# EAGLE schematic emonDCduo-ESP v2.3_consistency_error (EAGLE 9.2.1)
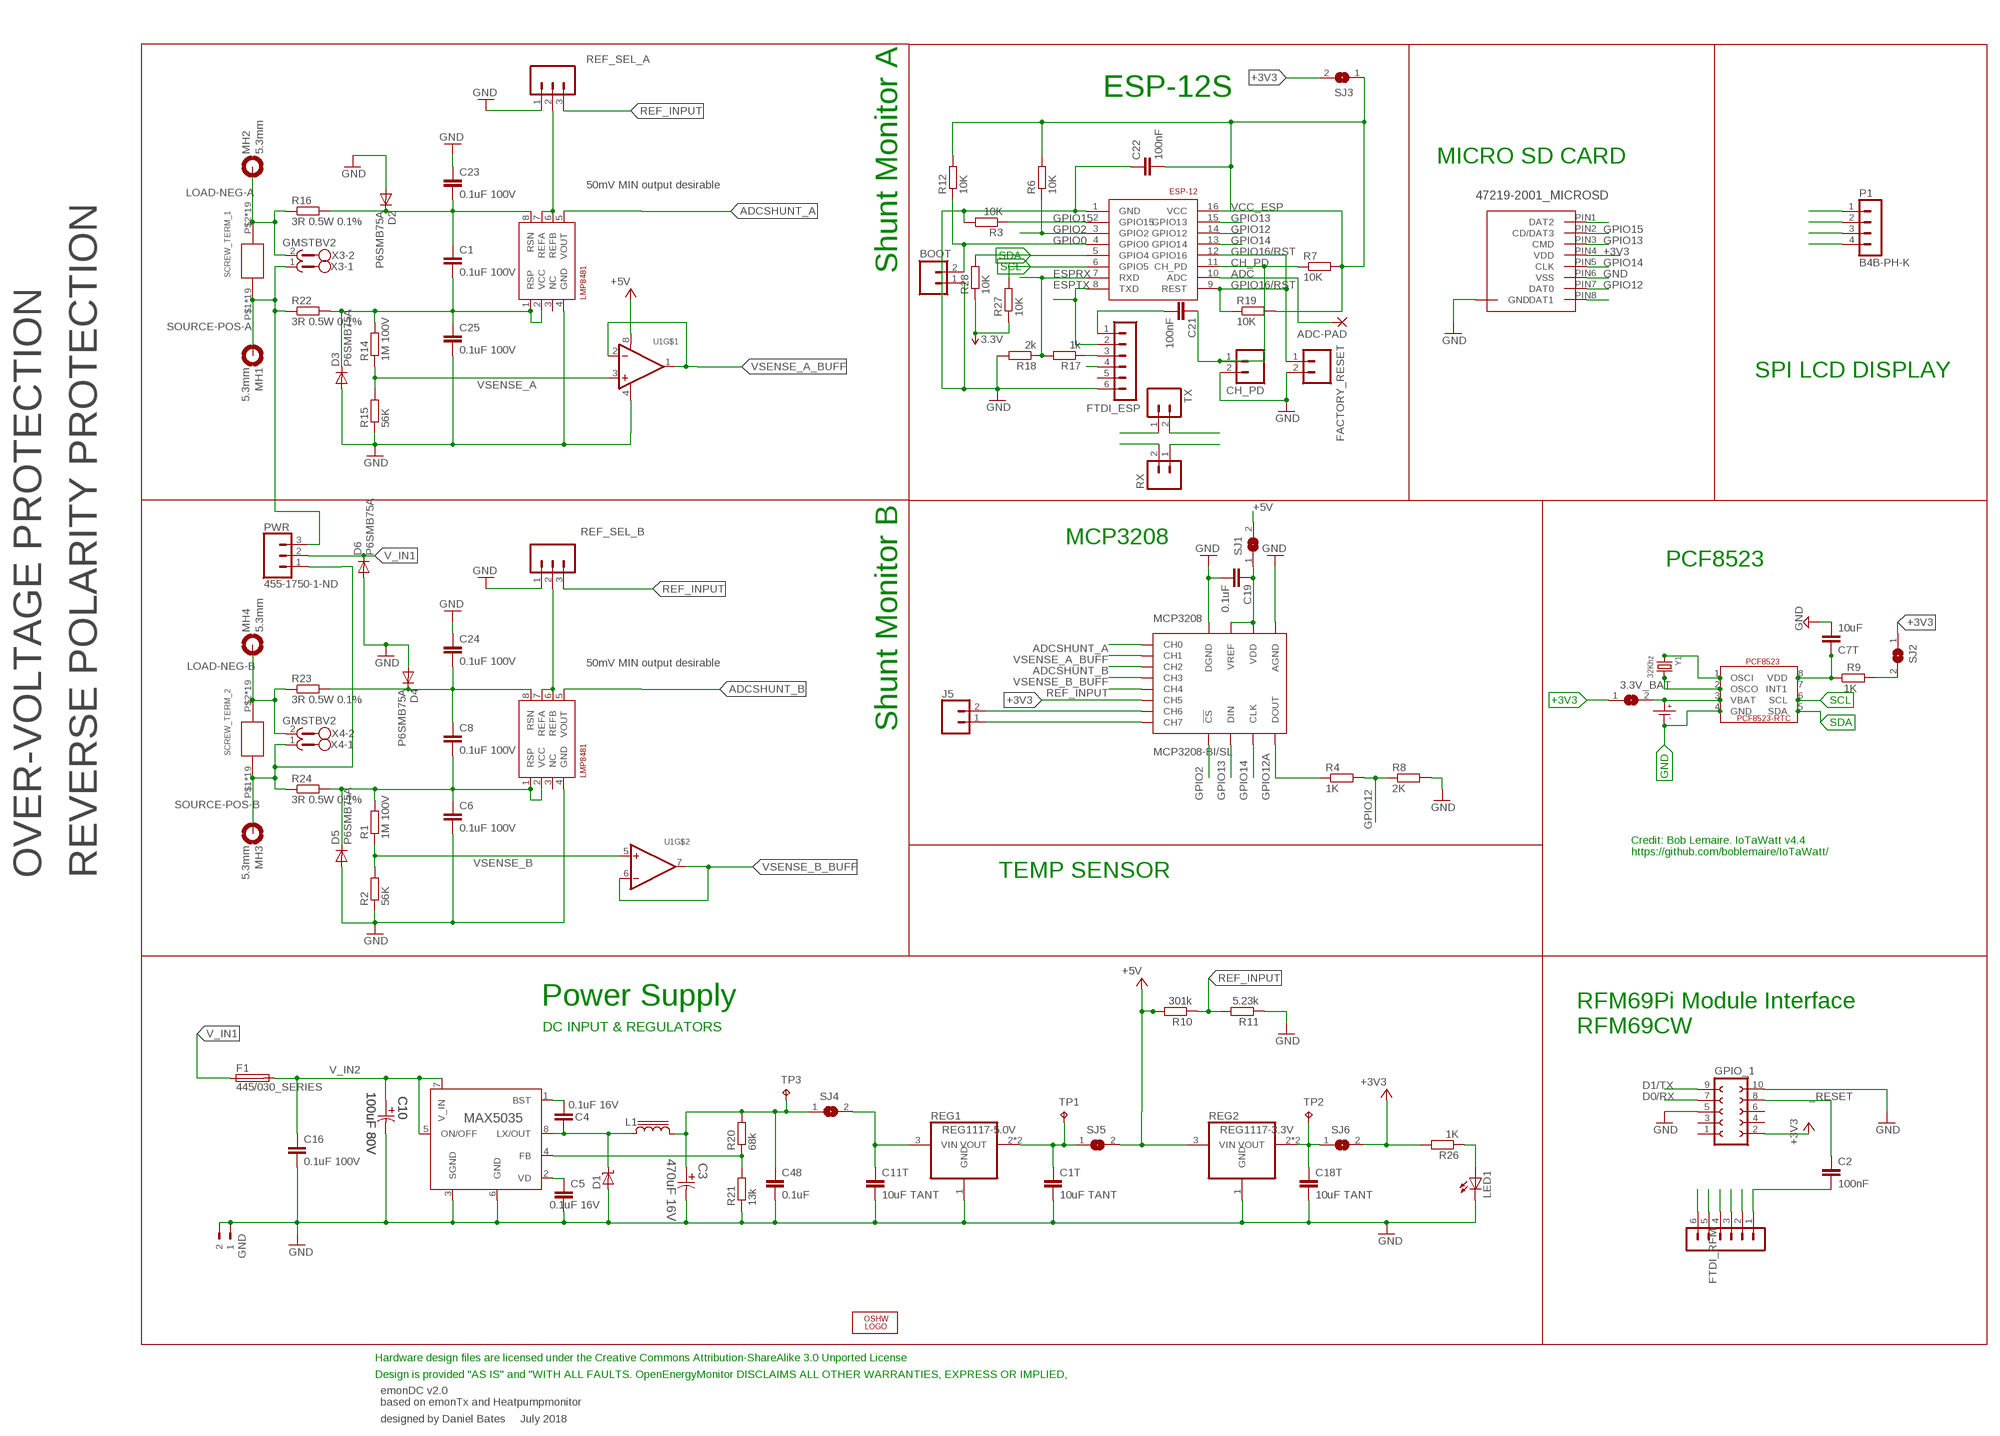
[diagram p0: schematic, sheet 1]

## Parts
3.3V_BAT  SJ-CONCON  [SJ-CON]
ADC-PAD  2,15/1,0  [2,15/1,0]
BOOT  M02PTH  [1X02]
C1  0.1uF 100V  C-EUC0603  [C0603]
C1T  10uF TANT  C-EUC0603  [C0603]
C2  100nF  C-EUC0603  [C0603]
C3  470uF 16V  EEE-FK1C471P-CASE-F  [CAPAE830X1050N]
C4  0.1uF 16V  C-EUC0603  [C0603]
C5  0.1uF 16V  C-EUC0603  [C0603]
C6  0.1uF 100V  C-EUC0603  [C0603]
C7T  10uF  C-EUC0603  [C0603]
C8  0.1uF 100V  C-EUC0603  [C0603]
C10  100uF 80V  EEV-FK1K101Q-CASE-H13  [CAPAE1350X1400N]
C11T  10uF TANT  C-EUC0603  [C0603]
C16  0.1uF 100V  C-EUC0603  [C0603]
C18T  10uF TANT  C-EUC0603  [C0603]
C19  0.1uF  C-EUC0603  [C0603]
C21  100nF  C-EUC0603  [C0603]
C22  100nF  C-EUC0603  [C0603]
C23  0.1uF 100V  C-EUC0603  [C0603]
C24  0.1uF 100V  C-EUC0603  [C0603]
C25  0.1uF 100V  C-EUC0603  [C0603]
C48  0.1uF  C-EUC0603  [C0603]
CH_PD  M02PTH  [1X02]
CR1220  CR1220SMD  [CR1220SMD]
D1  MBRS1100T3G  [SMB_1]
D2  P6SMB75A  DIODE-DO214AA  [DO214AA]
D3  P6SMB75A  DIODE-DO214AA  [DO214AA]
D4  P6SMB75A  DIODE-DO214AA  [DO214AA]
D5  P6SMB75A  DIODE-DO214AA  [DO214AA]
D6  P6SMB75A  DIODE-DO214AA  [DO214AA]
ESP-12  ESP8266_ESP-12  [ESP8266-ESP12]
F1  445/030_SERIES  [445/030_SERIES_LITTELFUSE]
FTDI_ESP  FTDI_ESP  MA06-1  [MA06-1]
FTDI_RFM  FTDI_RFM  MA06-1  [MA06-1]
GND  180-2  [180-2]
GPIO_1  FE05-2_RFM69PI_OUTLINERFM69PI  [FE05-2_RFM69PI_OULTINE]
IO16  FACTORY_RESET  M02PTH  [1X02]
J5  CONN_02  [1X02]
L1  SRR1208  [SSR1208]
LED1  LEDCHIP-LED0805  [CHIP-LED0805]
LOGO1  OSHW_LOGO_6MILX0200-NT  [OSHW_6X200_NOTEXT]
MCP3208  MCP3208-BI/SL  [SOIC16]
MH1  5.3mm  MOUNT-PAD-ROUND5.3  [5,3//11-PAD]
MH2  5.3mm  MOUNT-PAD-ROUND5.3  [5,3//11-PAD]
MH3  5.3mm  MOUNT-PAD-ROUND5.3  [5,3//11-PAD]
MH4  5.3mm  MOUNT-PAD-ROUND5.3  [5,3//11-PAD]
MICRO_SD  47219-2001_MICROSD  [47219-2001_MICROSD]
P1  B4B-PH-K  [B4B-PH-K]
PCF8523  PCF8523_RTC  [SOIC_8]
PWR  455-1750-1-ND  CONN_03  [1X03]
R1  1M 100V  R-EU_R0603  [R0603]
R2  56K  R-EU_R0603  [R0603]
R3  10K  R-EU_R0603  [R0603]
R4  1K  R-EU_R0603  [R0603]
R6  10K  R-EU_R0603  [R0603]
R7  10K  R-EU_R0603  [R0603]
R8  2K  R-EU_R0603  [R0603]
R9  1K  R-EU_R0603  [R0603]
R10  301k  R-EU_0204/7  [0204/7]
R11  5.23k  R-EU_0204/7  [0204/7]
R12  10K  R-EU_R0603  [R0603]
R14  1M 100V  R-EU_R0603  [R0603]
R15  56K  R-EU_R0603  [R0603]
R16  3R 0.5W 0.1%  R-EU_R0805  [R0805]
R17  1k  R-EU_R0603  [R0603]
R18  2k  R-EU_R0603  [R0603]
R19  10K  R-EU_R0603  [R0603]
R20  68k  R-EU_R0603  [R0603]
R21  13k  R-EU_R0603  [R0603]
R22  3R 0.5W 0.1%  R-EU_R0805  [R0805]
R23  3R 0.5W 0.1%  R-EU_R0805  [R0805]
R24  3R 0.5W 0.1%  R-EU_R0805  [R0805]
R26  1K  R-EU_R0603  [R0603]
R27  10K  R-EU_R0603  [R0603]
R28  10K  R-EU_R0603  [R0603]
REF_SEL_A  455-1750-1-ND  CONN_03  [1X03]
REF_SEL_B  455-1750-1-ND  CONN_03  [1X03]
REG0  MAX5035  [21-0111D_SBE-14]
REG1  REG1117-5.0V  REG1117  [SOT223]
REG2  REG1117-3.3V  REG1117  [SOT223]
RX  M02PTH  [1X02]
SCREW_TERM_1  EBW_SERIES_15.2MM  [EBW_SERIES_15.2MM]
SCREW_TERM_2  EBW_SERIES_15.2MM  [EBW_SERIES_15.2MM]
SHUNTMON-A  LMP8481  LMP8481-H  [S-PDSO-G08]
SHUNTMON-B  LMP8481  LMP8481-H  [S-PDSO-G08]
SJ1  SJ-CONCON  [SJ-CON]
SJ2  SJ-CONCON  [SJ-CON]
SJ3  SJ-CONCON  [SJ-CON]
SJ4  SJ-CONCON  [SJ-CON]
SJ5  SJ-CONCON  [SJ-CON]
SJ6  SJ-CONCON  [SJ-CON]
TP1  TPPAD1-13  [P1-13]
TP2  TPPAD1-13  [P1-13]
TP3  TPPAD1-13  [P1-13]
TX  M02PTH  [1X02]
U1  LM358  [SOIC8_150MIL]
X3  GMSTBV2  [GMSTBV2]
X4  GMSTBV2  [GMSTBV2]
Y1  32Khz  CRYSTAL8X3.8SMT  [CRYSTAL_8X3.8]

## Nets
3.3V_PRE: C18T.1 REG2.2(VOUT) REG2.4(VOUT) SJ6.1 TP2.TP
5V_PRE [power]: C1T.1 REG1.2(VOUT) REG1.4(VOUT) SJ5.1 TP1.TP
6.5V: C11T.1 REG1.3(VIN) SJ4.2
+3V3: 3.3V_BAT.1 GPIO_1.2 MCP3208.6(CH5) MICRO_SD.PIN4(VDD) P1.3 R26.2 R27.1 R28.1 SJ2.1 SJ3.2 SJ6.2 ; supply symbol labelled 3.3V
+5V: FTDI_ESP.4 FTDI_RFM.4 R10.2 REG2.3(VIN) SJ1.2 SJ5.2 U1.8(V+)
_RESET: C2.1 GPIO_1.8
ADC: ADC-PAD.1(P) ESP-12.10(ADC)
ADCSHUNT_A: MCP3208.1(CH0) SHUNTMON-A.5(VOUT)
ADCSHUNT_B: MCP3208.3(CH2) SHUNTMON-B.5(VOUT)
BST: C4.1 REG0.1(BST)
CH6: J5.2 MCP3208.7(CH6)
CH7: J5.1 MCP3208.8(CH7)
CH_PD: C21.1 CH_PD.1 ESP-12.11(CH_PD) R7.1
D0/RX: FTDI_RFM.2 GPIO_1.7 TX.2
D1/TX: FTDI_RFM.3 GPIO_1.9 RX.1
ESPRX: ESP-12.7(RXD) R17.2 R18.1 RX.2
ESPTX: ESP-12.8(TXD) FTDI_ESP.2 TX.1
GND [thin_power]: BOOT.1 C1T.2 C3.2 C5.2 C6.2 C7T.2 C10.2 C11T.2 C16.2 C18T.2 C19.2 C22.1 C23.1 C24.1 C25.2 C48.2 CH_PD.2 CR1220.P-(P$-) D1.A D2.A D3.A D4.A D5.A D6.A ESP-12.1(GND) FTDI_ESP.6 FTDI_RFM.6 GND.1 GND.2 GPIO_1.5 GPIO_1.10 IO16.2 LED1.C MCP3208.9(DGND) MCP3208.14(AGND) MICRO_SD.P$1(GND) MICRO_SD.P$2(GND) MICRO_SD.P$3(GND) MICRO_SD.P$4(GND) MICRO_SD.PIN6(VSS) P1.4 PCF8523.4(GND) R2.1 R3.2 R8.2 R11.1 R15.1 R18.2 R21.1 REF_SEL_A.1 REF_SEL_B.1 REG0.3(SGND) REG0.6(GND) REG1.1(GND) REG2.1(GND) SHUNTMON-A.4(GND) SHUNTMON-B.4(GND) U1.4(V-)
GPIO0: BOOT.2 ESP-12.4(GPIO0) R12.1
GPIO2: ESP-12.3(GPIO2) MCP3208.10(!CS) R6.1
GPIO12: ESP-12.14(GPIO12) MICRO_SD.PIN7(DAT0) R4.2 R8.1
GPIO12A: MCP3208.12(DOUT) R4.1
GPIO13: ESP-12.15(GPIO13) MCP3208.11(DIN) MICRO_SD.PIN3(CMD)
GPIO14: ESP-12.13(GPIO14) MCP3208.13(CLK) MICRO_SD.PIN5(CLK)
GPIO15 [thin_power]: ESP-12.2(GPIO15) MICRO_SD.PIN2(CD/DAT3) R3.1
GPIO16/RST: ESP-12.9(REST) ESP-12.12(GPIO16) IO16.1 R19.1
LOAD-NEG-A: MH2.B5,5(MOUNT) R16.1 SCREW_TERM_1.P$2 SCREW_TERM_1.P$18 SCREW_TERM_1.P$19 SCREW_TERM_1.P$20 SCREW_TERM_1.P$21 SCREW_TERM_1.P$22 SCREW_TERM_1.P$23 SCREW_TERM_1.P$24 SCREW_TERM_1.P$25 SCREW_TERM_1.P$26 SCREW_TERM_1.P$27 SCREW_TERM_1.P$28 SCREW_TERM_1.P$29 SCREW_TERM_1.P$30 SCREW_TERM_1.P$31 SCREW_TERM_1.P$32 SCREW_TERM_1.P$36 SCREW_TERM_1.P$37 SCREW_TERM_1.P$38 X3.2
LOAD-NEG-B: MH4.B5,5(MOUNT) R23.1 SCREW_TERM_2.P$2 SCREW_TERM_2.P$18 SCREW_TERM_2.P$19 SCREW_TERM_2.P$20 SCREW_TERM_2.P$21 SCREW_TERM_2.P$22 SCREW_TERM_2.P$23 SCREW_TERM_2.P$24 SCREW_TERM_2.P$25 SCREW_TERM_2.P$26 SCREW_TERM_2.P$27 SCREW_TERM_2.P$28 SCREW_TERM_2.P$29 SCREW_TERM_2.P$30 SCREW_TERM_2.P$31 SCREW_TERM_2.P$32 SCREW_TERM_2.P$36 SCREW_TERM_2.P$37 SCREW_TERM_2.P$38 X4.2
LX: C4.2 D1.C L1.1 REG0.8(LX/OUT)
MCP_VCC [power]: C19.1 MCP3208.15(VREF) MCP3208.16(VDD) SJ1.1
N$1: R20.1 R21.2 REG0.4(FB)
N$5: LED1.A R26.1
N$7: MICRO_SD.PIN1(DAT2)
N$10: C7T.1 PCF8523.8(VDD) R9.1
N$17: C1.1 C23.2 D2.C R16.2 SHUNTMON-A.8(RSN)
N$20: FTDI_RFM.5
N$22: C8.1 C24.2 D4.C R23.2 SHUNTMON-B.8(RSN)
N$23: C1.2 C25.1 D3.C R14.2 R22.2 SHUNTMON-A.1(RSP) SHUNTMON-A.2(VCC)
N$24: R9.2 SJ2.2
N$30: C21.2 FTDI_ESP.1
N$32: MICRO_SD.PIN8(DAT1)
N$36: FTDI_ESP.3 R17.1
N$44: PCF8523.2(OSCO) Y1.P$4
N$45: PCF8523.1(OSCI) Y1.P$1
N$301: C2.2 FTDI_RFM.1
PRE_6.5V: C3.1 C48.1 L1.2 R20.2 SJ4.1 TP3.TP
REF_A_INPUT: REF_SEL_A.2 SHUNTMON-A.6(REFB) SHUNTMON-A.7(REFA)
REF_B_INPUT [thin_power]: REF_SEL_B.2 SHUNTMON-B.6(REFB) SHUNTMON-B.7(REFA)
REF_INPUT: MCP3208.5(CH4) R10.1 R11.2 REF_SEL_A.3 REF_SEL_B.3
SCL: ESP-12.6(GPIO5) P1.2 PCF8523.6(SCL) R27.2
SDA: ESP-12.5(GPIO4) P1.1 PCF8523.5(SDA) R28.2
SOURCE-POS-A: MH1.B5,5(MOUNT) PWR.3 R22.1 SCREW_TERM_1.P$1 SCREW_TERM_1.P$3 SCREW_TERM_1.P$4 SCREW_TERM_1.P$5 SCREW_TERM_1.P$6 SCREW_TERM_1.P$7 SCREW_TERM_1.P$8 SCREW_TERM_1.P$9 SCREW_TERM_1.P$10 SCREW_TERM_1.P$11 SCREW_TERM_1.P$12 SCREW_TERM_1.P$13 SCREW_TERM_1.P$14 SCREW_TERM_1.P$15 SCREW_TERM_1.P$16 SCREW_TERM_1.P$17 SCREW_TERM_1.P$33 SCREW_TERM_1.P$34 SCREW_TERM_1.P$35 X3.1
SOURCE-POS-B [power]: MH3.B5,5(MOUNT) PWR.1 R24.1 SCREW_TERM_2.P$1 SCREW_TERM_2.P$3 SCREW_TERM_2.P$4 SCREW_TERM_2.P$5 SCREW_TERM_2.P$6 SCREW_TERM_2.P$7 SCREW_TERM_2.P$8 SCREW_TERM_2.P$9 SCREW_TERM_2.P$10 SCREW_TERM_2.P$11 SCREW_TERM_2.P$12 SCREW_TERM_2.P$13 SCREW_TERM_2.P$14 SCREW_TERM_2.P$15 SCREW_TERM_2.P$16 SCREW_TERM_2.P$17 SCREW_TERM_2.P$33 SCREW_TERM_2.P$34 SCREW_TERM_2.P$35 X4.1
SOURCE-POS-B_T: C6.1 C8.2 D5.C R1.2 R24.2 SHUNTMON-B.1(RSP) SHUNTMON-B.2(VCC)
V_IN1: D6.C F1.P$1 F1.P$2 PWR.2
V_IN2: C10.1 C16.1 F1.P$3 F1.P$4 REG0.5(ON/OFF) REG0.7(V_IN)
VBAT: 3.3V_BAT.2 CR1220.P+(P$+) PCF8523.3(VBAT)
VCC_ESP: C22.2 ESP-12.16(VCC) R6.2 R7.2 R12.2 R19.2 SJ3.1
VD: C5.1 REG0.2(VD)
VSENSE_A: R14.1 R15.2 U1.3(+IN)
VSENSE_A_BUFF: MCP3208.2(CH1) U1.1(OUT) U1.2(-IN)
VSENSE_B: R1.1 R2.2 U1.5(+IN)
VSENSE_B_BUFF: MCP3208.4(CH3) U1.6(-IN) U1.7(OUT)
Unconnected: FTDI_ESP.5 GPIO_1.1 GPIO_1.3 GPIO_1.4 GPIO_1.6 PCF8523.7(INT1) SHUNTMON-A.3(NC) SHUNTMON-B.3(NC)

## Notes on the sheet
- ESP-12S
- MICRO SD CARD
- 50mV MIN output desirable
- Shunt Monitor A
- SPI LCD DISPLAY
- MCP3208
- PCF8523
- 50mV MIN output desirable
- Shunt Monitor B
- Credit: Bob Lemaire. IoTaWatt v4.4
  https://github.com/boblemaire/IoTaWatt/
- OVER-VOLTAGE PROTECTION | REVERSE POLARITY PROTECTION | TEMP SENSOR
- Power Supply
- DC INPUT & REGULATORS
- RFM69Pi Module Interface
  RFM69CW
- Hardware design files are licensed under the Creative Commons Attribution-ShareAlike 3.0 Unported License
- Design is provided "AS IS" and "WITH ALL FAULTS. OpenEnergyMonitor DISCLAIMS ALL OTHER WARRANTIES, EXPRESS OR IMPLIED,
- emonDC v2.0
  based on emonTx and Heatpumpmonitor
- designed by Daniel Bates     July 2018

## Library data of the parts
3.3V_BAT SJ4 = jumper-con:SJ-CON: SMD solder JUMPER
ADC-PAD = wirepad:2,15/1,0: THROUGH-HOLE PAD
BOOT CH_PD IO16 RX TX = SparkFun:M02: Header 2 Standard 2-pin 0.1" header. Use with straight break away headers (SKU : PRT-00116), right angle break away headers (PRT-00553), swiss pins (PRT-00743), machine pins (PRT-00117), and female headers (PRT-00115). Molex polarized connector foot print use with SKU : PRT-08233 with associated crimp pins and housings.
C1 C6 C8 C23-C25 = rcl:C-EU: CAPACITOR, European symbol; MPN: C1608X7S2A104K080AB
C1T C2 C4 C5 C11T C16 C18T C19 C21 C22 C48 = rcl:C-EU: CAPACITOR, European symbol
C3 = Panasonic-EEEFK_EEEFP:EEE-: Aluminum Electrolytic Capacitors,Surface Mount Type; MPN: EEE-FK1C471P; OC_FARNELL: 9695710; OC_NEWARK: 96K9385; PACKAGE: CASE-F; SUPPLIER: PANASONIC; TOLERANCE: ±20 %; VALUE: 470UF; VOLTAGERATING: 16V
C7T = rcl@1:C-EU: CAPACITOR, European symbol
C10 = Panasonic-EEE-EEV-EEF-ECQ:EEV-: Aluminum Electrolytic Capacitors,Surface Mount Type; MPN: EEVFK1K101Q; OC_FARNELL: 9696113; OC_NEWARK: 96K9484; SUPPLIER: PANASONIC; TOLERANCE: ±20 %; VALUE: 100UF; VOLTAGERATING: 80V
CR1220 = IotaWatt_parts:CR1220SMD: CR1220 Battery SMD; MPN: Harwin S8411-45R
D1 = diodes:MBRS1100T3G: MBRS1100T3G 100V 1A Freewheeling Diode; MPN: MBRS1100T3G
D2-D6 = diode:DIODE-: DIODE
ESP-12 = ESP8266-ESP12:ESP8266_ESP-12
F1 = LITTELFUSE 455:030 SERIES:445/030_SERIES: MPN 04450001N
FTDI_ESP FTDI_RFM = JeeLabs:MA06-1: PIN HEADER
GND = con-weidmueller-sl35_db:180-2: WEIDMUELLER CLAMP CONNECTOR; OC_FARNELL: unknown; OC_NEWARK: unknown
GPIO_1 = con-lsta-RFM69Pi:FE05-2_RFM69PI_OUTLINE: FEMALE HEADER
J5 = SparkFun-Connectors:CONN_02: Multi connection point. Often used as Generic Header-pin footprint for 0.1 inch spaced/style header connections On any of the 0.1 inch spaced packages, you can populate with these: Break Away Headers - Straight <https://www.sparkfun.com/products/116> (PRT-00116) Break Away Male Headers - Right Angle <https://www.sparkfun.com/products/553> (PRT-00553) Female Headers <https://www.sparkfun.com/products/115> (PRT-00115) Break Away Headers - Machine Pin <https://www.sparkfun.com/products/117> (PRT-00117) Break Away Female Headers - Swiss Machine Pin <https://www.sparkfun.com/products/743> (PRT-00743) For SCREWTERMINALS and SPRING TERMINALS visit here: Screw Terimnals on SparkFun.com <https://www.sparkfun.com/search/results?term=Screw+Terminals> (5mm/3.5mm/2.54mm spacing) This device is also useful as a general connection point to wire up your design to another part of your project. Our various solder wires solder well into these plated through hole pads. Hook-Up Wire - Assortment (Stranded, 22 AWG) <https://www.sparkfun.com/products/11375> (PRT-11375) Hook-Up Wire - Assortment (Solid Core, 22 AWG) <https://www.sparkfun.com/products/11367> (PRT-11367) View the entire wire category on our website here <https://www.sparkfun.com/categories/141> Special notes: Molex polarized connector foot print use with: PRT-08233 with associated crimp pins and housings. 2.54_SCREWTERM for use with PRT-10571. 3.5mm Screw Terminal footprints for PRT-08084 5mm Screw Terminal footprints for use with PRT-08432
L1 = inductor-bourns:SRR1208: POWER INDUCTOR; MPN: SRR1208-151YL
LED1 = led:LED: LED OSRAM: - CHIPLED LG R971, LG N971, LY N971, LG Q971, LY Q971, LO R971, LY R971 LH N974, LH R974 LS Q976, LO Q976, LY Q976 LO Q996 - Hyper CHIPLED LW Q18S LB Q993, LB Q99A, LB R99A - SideLED LS A670, LO A670, LY A670, LG A670, LP A670 LB A673, LV A673, LT A673, LW A673 LH A674 LY A675 LS A676, LA A676, LO A676, LY A676, LW A676 LS A679, LY A679, LG A679 - Hyper Micro SIDELED® LS Y876, LA Y876, LO Y876, LY Y876 LT Y87S - SmartLED LW L88C, LW L88S LB L89C, LB L89S, LG L890 LS L89K, LO L89K, LY L89K LS L896, LA L896, LO L896, LY L896 - TOPLED LS T670, LO T670, LY T670, LG T670, LP T670 LSG T670, LSP T670, LSY T670, LOP T670, LYG T670 LG T671, LOG T671, LSG T671 LB T673, LV T673, LT T673, LW T673 LH T674 LS T676, LA T676, LO T676, LY T676, LB T676, LH T676, LSB T676, LW T676 LB T67C, LV T67C, LT T67C, LS T67K, LO T67K, LY T67K, LW E67C LS E67B, LA E67B, LO E67B, LY E67B, LB E67C, LV E67C, LT E67C LW T67C LS T679, LY T679, LG T679 LS T770, LO T770, LY T770, LG T770, LP T770 LB T773, LV T773, LT T773, LW T773 LH T774 LS E675, LA E675, LY E675, LS T675 LS T776, LA T776, LO T776, LY T776, LB T776 LHGB T686 LT T68C, LB T68C - Hyper Mini TOPLED® LB M676 - Mini TOPLED Santana® LG M470 LS M47K, LO M47K, LY M47K Source: http://www.osram.convergy.de LUXEON: - LUMILED® LXK2-PW12-R00, LXK2-PW12-S00, LXK2-PW14-U00, LXK2-PW14-V00 LXK2-PM12-R00, LXK2-PM12-S00, LXK2-PM14-U00 LXK2-PE12-Q00, LXK2-PE12-R00, LXK2-PE12-S00, LXK2-PE14-T00, LXK2-PE14-U00 LXK2-PB12-K00, LXK2-PB12-L00, LXK2-PB12-M00, LXK2-PB14-N00, LXK2-PB14-P00, LXK2-PB14-Q00 LXK2-PR12-L00, LXK2-PR12-M00, LXK2-PR14-Q00, LXK2-PR14-R00 LXK2-PD12-Q00, LXK2-PD12-R00, LXK2-PD12-S00 LXK2-PH12-R00, LXK2-PH12-S00 LXK2-PL12-P00, LXK2-PL12-Q00, LXK2-PL12-R00 Source: www.luxeon.com KINGBRIGHT: KA-3528ASYC Source: www.kingbright.com
LOGO1 = ohw-logo:OSHW_LOGO_6MIL; OC_FARNELL: unknown
MCP3208 = MCP3208:MCP3208
MH1-MH4 = holes-db:MOUNT-PAD-ROUND: MOUNTING PAD, round
MICRO_SD = MOLEX 47219-2001:47219-2001_MICROSD
P1 = JST-PH:B4B-PH-K: HEADER
PCF8523 = emonDC parts:PCF8523_RTC: PCF8523-RTC SOIC-8
PWR = SparkFun-Connectors:CONN_03: Multi connection point. Often used as Generic Header-pin footprint for 0.1 inch spaced/style header connections On any of the 0.1 inch spaced packages, you can populate with these: Break Away Headers - Straight <https://www.sparkfun.com/products/116> (PRT-00116) Break Away Male Headers - Right Angle <https://www.sparkfun.com/products/553> (PRT-00553) Female Headers <https://www.sparkfun.com/products/115> (PRT-00115) Break Away Headers - Machine Pin <https://www.sparkfun.com/products/117> (PRT-00117) Break Away Female Headers - Swiss Machine Pin <https://www.sparkfun.com/products/743> (PRT-00743) Stackable Header - 3 Pin (Female, 0.1") <https://www.sparkfun.com/products/13875> (PRT-13875) For SCREWTERMINALS and SPRING TERMINALS visit here: Screw Terimnals on SparkFun.com <https://www.sparkfun.com/search/results?term=Screw+Terminals> (5mm/3.5mm/2.54mm spacing) This device is also useful as a general connection point to wire up your design to another part of your project. Our various solder wires solder well into these plated through hole pads. Hook-Up Wire - Assortment (Stranded, 22 AWG) <https://www.sparkfun.com/products/11375> (PRT-11375) Hook-Up Wire - Assortment (Solid Core, 22 AWG) <https://www.sparkfun.com/products/11367> (PRT-11367) View the entire wire category on our website here <https://www.sparkfun.com/categories/141> Special notes: Molex polarized connector foot print use with SKU : PRT-08232 with associated crimp pins and housings.; PROD_ID: XXX-00000
R1 R14 = rcl:R-EU_: RESISTOR, European symbol; MPN: MCWR06X1003FTL
R2 R4 R8 R15 = rcl:R-EU_: RESISTOR, European symbol; MPN: MCWR06X5901FTL
R3 R6 R7 R12 R17-R19 R27 R28 = rcl:R-EU_: RESISTOR, European symbol
R9 R20 R21 = rcl@1:R-EU_: RESISTOR, European symbol
R10 R11 R16 R22-R24 R26 = rcl:R-EU_: RESISTOR, European symbol; SPICEPREFIX: R
REF_SEL_A REF_SEL_B = SparkFun-Connectors:CONN_03: Multi connection point. Often used as Generic Header-pin footprint for 0.1 inch spaced/style header connections On any of the 0.1 inch spaced packages, you can populate with these: Break Away Headers - Straight <https://www.sparkfun.com/products/116> (PRT-00116) Break Away Male Headers - Right Angle <https://www.sparkfun.com/products/553> (PRT-00553) Female Headers <https://www.sparkfun.com/products/115> (PRT-00115) Break Away Headers - Machine Pin <https://www.sparkfun.com/products/117> (PRT-00117) Break Away Female Headers - Swiss Machine Pin <https://www.sparkfun.com/products/743> (PRT-00743) Stackable Header - 3 Pin (Female, 0.1") <https://www.sparkfun.com/products/13875> (PRT-13875) For SCREWTERMINALS and SPRING TERMINALS visit here: Screw Terimnals on SparkFun.com <https://www.sparkfun.com/search/results?term=Screw+Terminals> (5mm/3.5mm/2.54mm spacing) This device is also useful as a general connection point to wire up your design to another part of your project. Our various solder wires solder well into these plated through hole pads. Hook-Up Wire - Assortment (Stranded, 22 AWG) <https://www.sparkfun.com/products/11375> (PRT-11375) Hook-Up Wire - Assortment (Solid Core, 22 AWG) <https://www.sparkfun.com/products/11367> (PRT-11367) View the entire wire category on our website here <https://www.sparkfun.com/categories/141> Special notes: Molex polarized connector foot print use with SKU : PRT-08232 with associated crimp pins and housings.; MF: MULTICOMP; MPN: 2212S-02SG-85; OC_FARNELL: 1593458; PROD_ID: XXX-00000
REG0 = MAX5035:MAX5035: SWITCHING REGULATOR 5.0V 1.0A; MPN: MAX5035EASA+
REG1 = burr-brown-db:REG1117: 800mA and 1A Low Dropout (LDO) Positive Regulator 1.8V, 2.5V, 2.85V, 3.3V, 5V, and Adj; MF: TEXAS INSTRUMENTS; MPN: REG1117-5.0; OC_FARNELL: 1097566; OC_NEWARK: 14P6981
REG2 = burr-brown-db:REG1117: 800mA and 1A Low Dropout (LDO) Positive Regulator 1.8V, 2.5V, 2.85V, 3.3V, 5V, and Adj; MF: TEXAS INSTRUMENTS; MPN: REG1117-3.3; OC_FARNELL: 1097566; OC_NEWARK: 14P6981
SCREW_TERM_1 SCREW_TERM_2 = EBW series SHUNT:EBW_SERIES_15.2MM
SHUNTMON-A = lmp8481b:LMP8481: LMP8481MM-H/NOPB 100V/V; MF: TEXAS INSTRUMENTS; MPN: LMP8481MME-S/NOPB; OC_FARNELL: 2322044
SHUNTMON-B = lmp8481b:LMP8481: LMP8481MM-H/NOPB 100V/V; MF: TEXAS INSTRUMENTS; MPN: LMP8481MME-H/NOPB; OC_FARNELL: 2322044
SJ1-SJ3 SJ5 SJ6 = jumper-con_db:SJ-CON: SMD solder JUMPER
TP1-TP3 = testpad:TP: Test pad
U1 = microbuilder:LM358: LM358 Dual Operational Amplifier Digikey: LM358AMXFSCT-ND
X3 X4 = con-phoenix-762:GMSTBV2: PHOENIX; MPN: GMSTBVA2,5/2-G-7,62; OC_FARNELL: 1793079; OC_NEWARK: 69R9520
Y1 = microbuilder:CRYSTAL: Crystals HC49UP - Surface Mount Crystal 4.0MHz 18pF +/-30ppm Surface Mount Crystal [Digikey: 535-9857-1-ND] 12.0 MHz Surface Mount Crystal [Digikey: 535-9869-6-ND] 25.0 MHz Surface Mount Crystal [Digikey: 535-9078-1-ND] 2.5 x 2.0mm - MEMs SMT Crystal 16.0 MHz 10pF 20ppm 2.5 x 2.0mm Crystal [Digikey -40-85°C: 535-10923-1-ND] 3.2 x 2.5mm - MEMs SMT Crystal 12.0 MHz 8pF 15ppm 3.2 x 2.5mm Crystal [Digikey: -10-70°C: 644-1047-1-ND -40-125°C: 644-1128-1-ND] 16.0 MHz 8pF 15ppm 3.2 x 2.5mm Crystal [Digikey: -10-70°C: 644-1049-1-ND -40-125°C: 644-1129-2-ND] 16.0 MHz 10pF 10ppm 3.2 x 2.5mm Crystal [Digikey: 644-1100-1-ND] 27.12 MHz 18pF 30ppm 3.2 x 2.5mm Crystal [Digikey: 887-1424-1-ND] 27.12MHz 10pF 10ppm 3.2 x 2.5mm Crystal [Digikey: 887-1329-1-ND] 4.9 x 1.8mm - MEMs SMT Crystal 32.768 KHz 12.5pF 20ppm 4.9 x 1.8mm Crystal [Digikey: SE2415CT-ND] 8.0 x 3.8mm - Surface Mount Crystal 32.768kHz 12.5pF 20ppm -40°C-85°C [Digikey: 535-9166-2-ND] Cylinder 32.768KHz Cylinder Crystal (2x6mm body) [Ex. Digikey: 300-8341-2-ND]

## Net classes
0 default: clearance 0.254 mm
1 power: clearance 0.559 mm
2 thin_power: clearance 0.406 mm